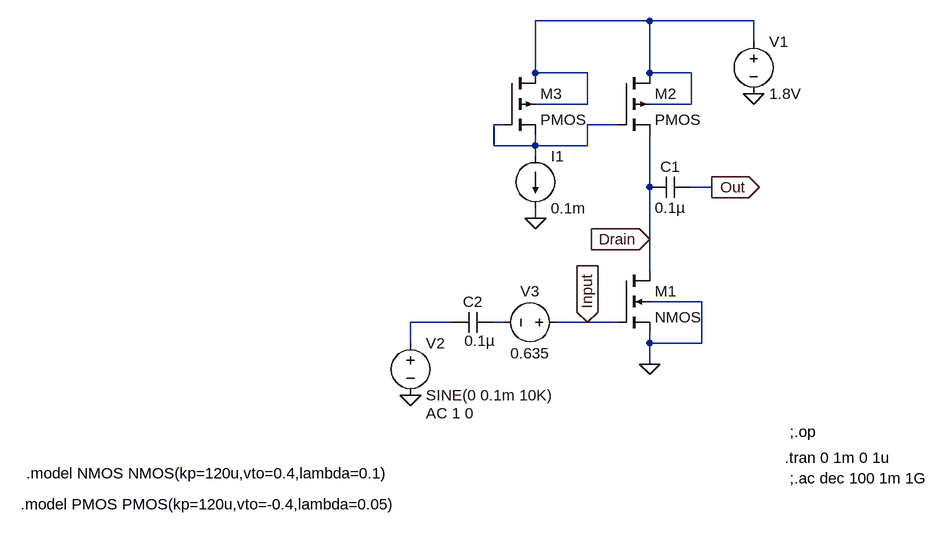
[diagram p0: schematic mirror.asc]
mirror.asc, the LTspice schematic file:
Version 4
SHEET 1 880 744
WIRE 240 -16 64 -16
WIRE 400 -16 240 -16
WIRE 400 16 400 -16
WIRE 64 64 64 -16
WIRE 144 64 64 64
WIRE 240 64 240 -16
WIRE 304 64 240 64
WIRE 144 112 144 64
WIRE 144 112 64 112
WIRE 304 112 304 64
WIRE 304 112 240 112
WIRE 16 144 0 144
WIRE 192 144 144 144
WIRE 0 176 0 144
WIRE 64 176 64 160
WIRE 64 176 0 176
WIRE 144 176 144 144
WIRE 144 176 64 176
WIRE 64 192 64 176
WIRE 240 240 240 160
WIRE 336 240 304 240
WIRE 64 288 64 272
WIRE 240 320 240 240
WIRE 240 368 240 320
WIRE 320 416 240 416
WIRE -64 448 -128 448
WIRE 16 448 0 448
WIRE 144 448 96 448
WIRE 192 448 144 448
WIRE -128 480 -128 448
WIRE 240 480 240 464
WIRE 320 480 320 416
WIRE 320 480 240 480
WIRE 240 512 240 480
FLAG 64 288 0
FLAG 240 512 0
FLAG 400 96 0
FLAG 336 240 Out
IOPIN 336 240 Out
FLAG 240 320 Drain
IOPIN 240 320 In
FLAG 144 448 Input
IOPIN 144 448 In
FLAG -128 560 0
SYMBOL pmos4 192 64 R0
SYMATTR InstName M2
SYMATTR Value2 l=10u w=10u
SYMBOL current 64 192 R0
WINDOW 123 0 0 Left 0
WINDOW 39 0 0 Left 0
SYMATTR InstName I1
SYMATTR Value 0.1m
SYMBOL voltage 400 0 R0
WINDOW 123 0 0 Left 0
WINDOW 39 0 0 Left 0
SYMATTR InstName V1
SYMATTR Value 1.8V
SYMBOL cap 304 224 R90
WINDOW 0 0 32 VBottom 2
WINDOW 3 32 32 VTop 2
SYMATTR InstName C1
SYMATTR Value 0.1µ
SYMBOL nmos4 192 368 R0
SYMATTR InstName M1
SYMATTR Value2 l=10u w=296u
SYMBOL pmos4 16 64 R0
SYMATTR InstName M3
SYMATTR Value2 l=10u w=10u
SYMBOL voltage -128 464 R0
WINDOW 123 24 124 Left 2
WINDOW 39 0 0 Left 0
SYMATTR Value2 AC 1 0
SYMATTR InstName V2
SYMATTR Value SINE(0 0.1m 10K)
SYMBOL cap 0 432 R90
WINDOW 0 0 32 VBottom 2
WINDOW 3 29 21 VTop 2
SYMATTR InstName C2
SYMATTR Value 0.1µ
SYMBOL voltage 112 448 R90
WINDOW 0 -32 56 VBottom 2
WINDOW 3 32 56 VTop 2
WINDOW 123 0 0 Left 0
WINDOW 39 0 0 Left 0
SYMATTR InstName V3
SYMATTR Value 0.635
TEXT -720 680 Left 2 !.model NMOS NMOS(kp=120u,vto=0.4,lambda=0.1)
TEXT -728 728 Left 2 !.model PMOS PMOS(kp=120u,vto=-0.4,lambda=0.05)
TEXT 448 656 Left 2 !.tran 0 1m 0 1u
TEXT 456 616 Left 2 !;.op
TEXT 456 688 Left 2 !;.ac dec 100 1m 1G

The netlist it stands for:
* mirror.asc
M2 N001 N002 Drain N001 PMOS l=10u w=10u
I1 N002 0 0.1m
V1 N001 0 1.8V
C1 Out Drain 0.1µ
M1 Drain Input 0 0 NMOS l=10u w=296u
M3 N001 N002 N002 N001 PMOS l=10u w=10u
V2 N003 0 SINE(0 0.1m 10K) AC 1 0
C2 N004 N003 0.1µ
V3 Input N004 0.635
.model NMOS NMOS
.model PMOS PMOS
.lib standard.mos
.model NMOS NMOS(kp=120u,vto=0.4,lambda=0.1)
.model PMOS PMOS(kp=120u,vto=-0.4,lambda=0.05)
.tran 0 1m 0 1u
;.op
;.ac dec 100 1m 1G
.backanno
.end